# EAGLE schematic USB (EAGLE 4.16)
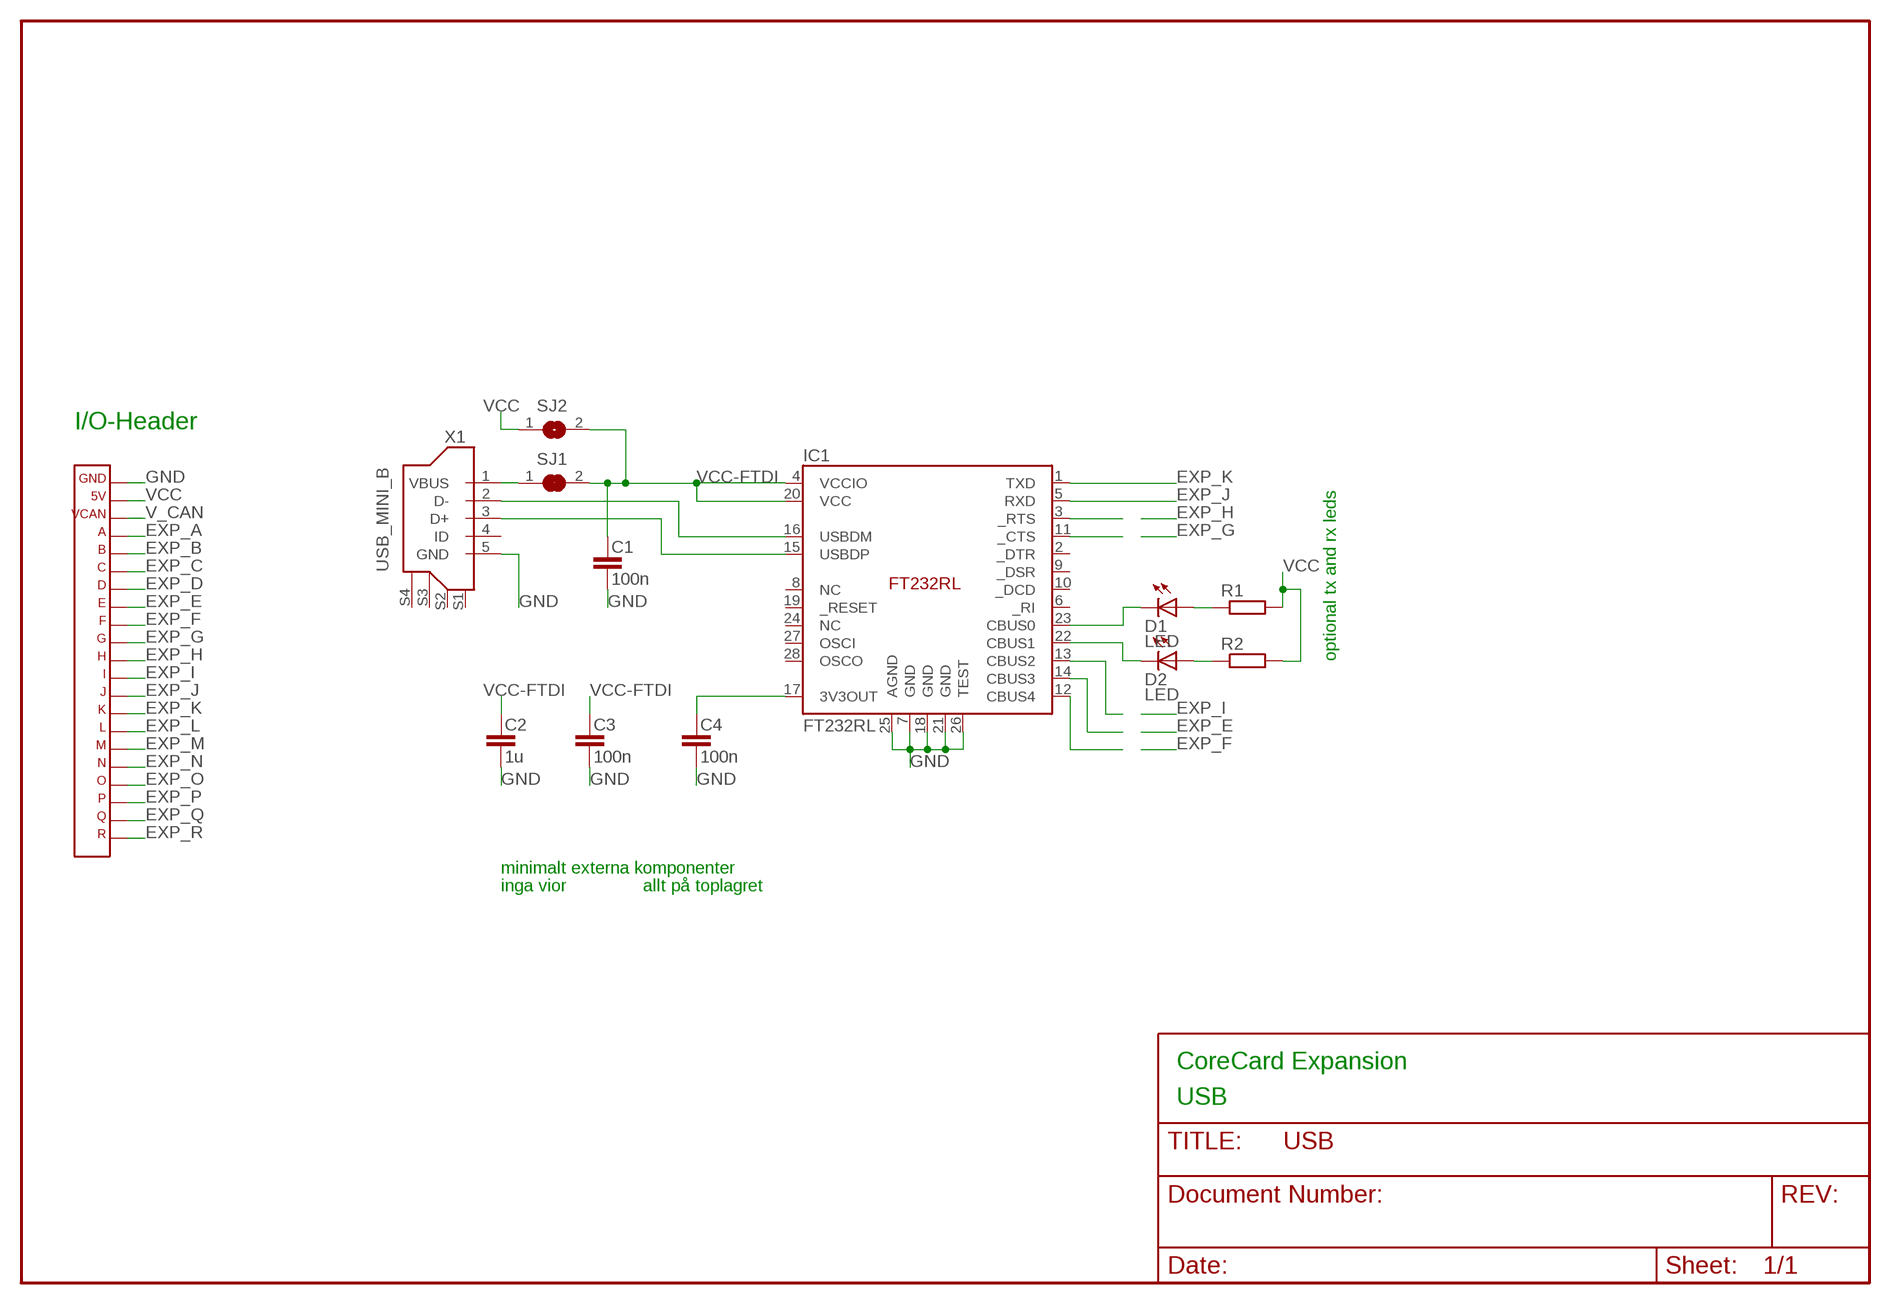
[diagram p0: schematic, sheet 1]

## Parts
C1  100n  C-EU  [C0603]
C2  1u  C-EU  [C0603]
C3  100n  C-EU  [C0603]
C4  100n  C-EU  [C0603]
D1  LED  [0603]
D2  LED  [0603]
IC1  FT232RL  [SSOP-28]
R1  R-EUR0603  [R0603]
R2  R-EUR0603  [R0603]
SJ1  SJ_NC  [SJ_NC]
SJ2  SJ_NO  [SJ_NO]
X1  USB_MINI_B  [MOLEX67503]
X3  CORE_IOHEADEXP  [CORE_IOHEAD_NOSILC]

## Nets
D+: IC1.15(USBDP) X1.3(D+)
D-: IC1.16(USBDM) X1.2(D-)
EXP_A: X3.4
EXP_B: X3.5
EXP_C: X3.6
EXP_D: X3.7
EXP_E: X3.8
EXP_F: X3.9
EXP_G: X3.10
EXP_H: X3.11
EXP_I: X3.12
EXP_J: IC1.5(RXD) X3.13
EXP_K: IC1.1(TXD) X3.14
EXP_L: X3.15
EXP_M: X3.16
EXP_N: X3.17
EXP_O: X3.18
EXP_P: X3.19
EXP_Q: X3.20
EXP_R: X3.21
GND: C1.2 C2.2 C3.2 C4.2 IC1.7(GND) IC1.18(GND) IC1.21(GND) IC1.25(AGND) IC1.26(TEST) X1.5(GND) X3.1
N$1: IC1.13(CBUS2)
N$2: IC1.14(CBUS3)
N$3: C4.1 IC1.17(3V3OUT)
N$4: IC1.11(_CTS)
N$5: IC1.3(_RTS)
N$6: D1.C IC1.23(CBUS0)
N$7: D2.C IC1.22(CBUS1)
N$8: D1.A R1.1
N$9: D2.A R2.1
N$10: IC1.12(CBUS4)
V_CAN: X3.3
VBUS: SJ1.1 X1.1(VBUS)
VCC: R1.2 R2.2 SJ2.1 X3.2
VCC-FTDI: C1.1 C2.1 C3.1 IC1.4(VCCIO) IC1.20(VCC) SJ1.2 SJ2.2
Unconnected: IC1.2(_DTR) IC1.6(_RI) IC1.8(NC) IC1.9(_DSR) IC1.10(_DCD) IC1.19(_RESET) IC1.24(NC) IC1.27(OSCI) IC1.28(OSCO) X1.4(ID) X1.S1 X1.S2 X1.S3 X1.S4

## Notes on the sheet
- I/O-Header
- optional tx and rx leds
- minimalt externa komponenter
- inga vior | allt på toplagret
- CoreCard Expansion
- USB

## Library data of the parts
C1-C4 = rcl:C-EU
D1 D2 = led:LED
IC1 = ftdi4:FT232RL
R1 R2 = rcl:R-EU
SJ1 = jumper:SJ_NC: SMD solder JUMPER
SJ2 = jumper:SJ_NO
X1 = usbminib:USB_MINI_B
X3 = expboard:CORE_IOHEAD: CoreCard IO-header for expansion cards